# Altium project DSUB-Platine-V2.PrjPcb
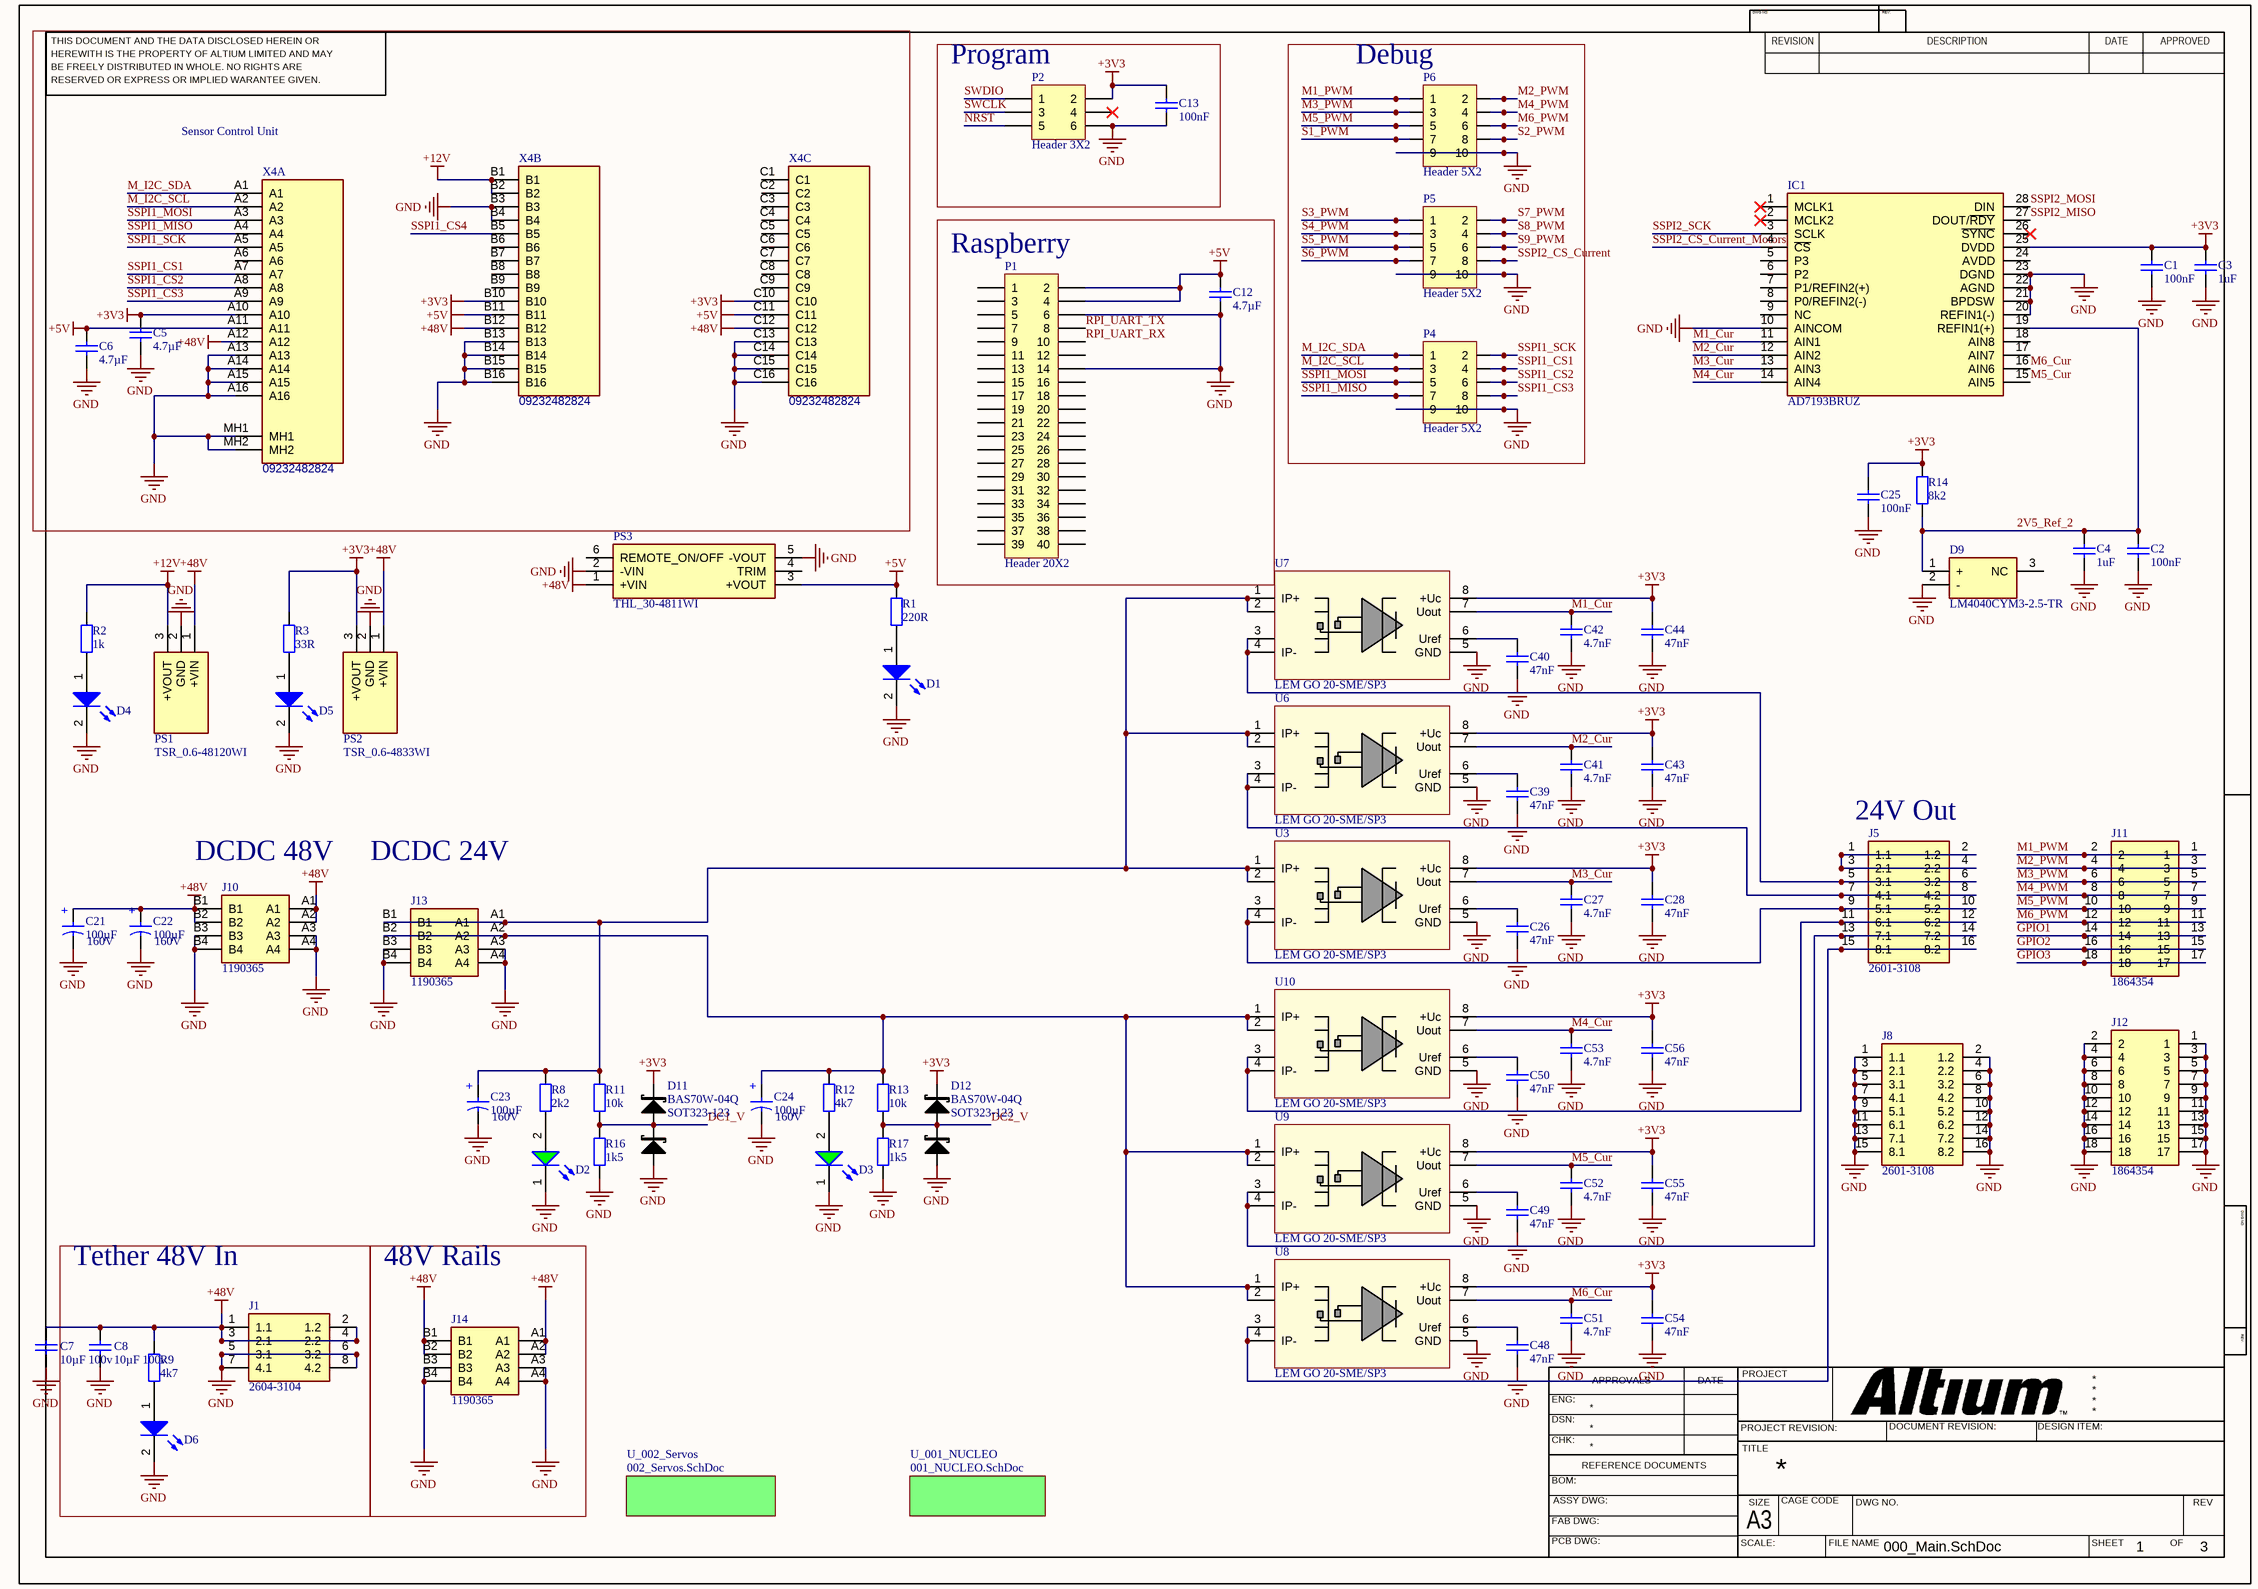
[diagram p0: 000_Main.SchDoc]
3 sheets, 125 parts. Net scope: global (net labels, ports and power ports of the same name join across sheets).
Board file: DSUB_V2_JGl_RoV24_RevA.PcbDoc
Sheets:
  000_Main.SchDoc
    U_001_NUCLEO = 001_NUCLEO.SchDoc
    U_002_Servos = 002_Servos.SchDoc

## Sheet 000_Main.SchDoc
size 420 x 297 mm; SheetNumber: 1; SheetTotal: 3; SPICEModelCacheKMNAYMJK: <root> / <DocumentId>KMNAYMJK</DocumentId> / <CacheFrame Number="0"> / <Model Name="0603_150060gs84000" Kind="CKT"> / <Text>****** / .subckt 0603_150060GS84000  1  2 / D1 1 2 SMCW / .MODEL SMCW D / + IS=695.94E-6 / + N=5 / + RS=2.4677 / + IKF=16.109E-12 / + CJO=1.0000E-12 / + M=.3333 / + VJ=.75 / + BV=5 / + IBV=100.00E-6 / + TT=5.0000E-9 / .ends</Text> / </Model> / <Model Name="0603_150060bs75003" Kind="CKT"> / <Text>****** / .subckt 0603_150060BS75003  1  2 / D1 1 2 SMCW / .MODEL SMCW D / + IS=695.94E-6 / + N=5 / + RS=2.4677 / + IKF=16.109E-12 / + CJO=1.0000E-12 / + M=.3333 / + VJ=.75 / + BV=5 / + IBV=10.00E-6 / + TT=5.0000E-9 / .ends</Text> / </Model> / <Model Name="1210_885012209048_4.7uf" Kind="CKT"> / <Text>******* / .subckt 1210_885012209048_4.7uF 1 2 / Rser 1 3 0.00278836774782 / Lser 2 4 2.60340728E-10 / C1 3 4 0.0000047 / Rpar 3 4 20000000 / .ends 1210_885012209048_4.7uF</Text> / </Model> / <Model Name="2220_885012214006_10uf" Kind="CKT"> / <Text>******* / .subckt 2220_885012214006_10uF 1 2 / Rser 1 3 0.003 / Lser 2 4 0.0000000012 / C1 3 4 0.00001 / Rpar 3 4 10000000 / .ends 2220_885012214006_10uF</Text> / </Model> / <Model Name="0805_885012207098r_100nf" Kind="CKT"> / <Text>******* / .subckt 0805_885012207098R_100nF 1 2 / Rser 1 3 0.0175748078756 / Lser 2 4 0.0000000004 / C1 3 4 0.0000001 / Rpar 3 4 5000000000 / .ends 0805_885012207098R_100nF</Text> / </Model> / </CacheFrame> / </root>

### Parts
C1  100nF  [6-0805_L]
C2  100nF  [6-0805_L]
C3  1uF  [6-0805_L]
C4  1uF  [6-0805_L]
C5  4.7µF  [WCAP-CSGP_1210_L3.2W2.5H2.5]
C6  4.7µF  [WCAP-CSGP_1210_L3.2W2.5H2.5]
C7  10µF 100v  [WCAP-CSGP_2220_L5.7W5H2.8]
C8  10µF 100v  [WCAP-CSGP_2220_L5.7W5H2.8]
C12  4.7µF  [WCAP-CSGP_1210_L3.2W2.5H2.5]
C13  100nF  [WCAP-CSGP_0805_L2W1.25H0.8_Reflow]
C21  Rated Voltage (DC): 160V  [WCAP-AT1H_D18H21]  (hidden comment: 100µF)
C22  Rated Voltage (DC): 160V  [WCAP-AT1H_D18H21]  (hidden comment: 100µF)
C23  Rated Voltage (DC): 160V  [WCAP-AT1H_D18H21]  (hidden comment: 100µF)
C24  Rated Voltage (DC): 160V  [WCAP-AT1H_D18H21]  (hidden comment: 100µF)
C25  100nF  [6-0805_L]
C26  47nF  [WCAP-CSGP_0805_L2W1.25H0.8_Reflow]
C27  4.7nF  [WCAP-CSGP_0805_L2W1.25H0.8_Reflow]
C28  47nF  [WCAP-CSGP_0805_L2W1.25H0.8_Reflow]
C39  47nF  [WCAP-CSGP_0805_L2W1.25H0.8_Reflow]
C40  47nF  [WCAP-CSGP_0805_L2W1.25H0.8_Reflow]
C41  4.7nF  [WCAP-CSGP_0805_L2W1.25H0.8_Reflow]
C42  4.7nF  [WCAP-CSGP_0805_L2W1.25H0.8_Reflow]
C43  47nF  [WCAP-CSGP_0805_L2W1.25H0.8_Reflow]
C44  47nF  [WCAP-CSGP_0805_L2W1.25H0.8_Reflow]
C48  47nF  [WCAP-CSGP_0805_L2W1.25H0.8_Reflow]
C49  47nF  [WCAP-CSGP_0805_L2W1.25H0.8_Reflow]
C50  47nF  [WCAP-CSGP_0805_L2W1.25H0.8_Reflow]
C51  4.7nF  [WCAP-CSGP_0805_L2W1.25H0.8_Reflow]
C52  4.7nF  [WCAP-CSGP_0805_L2W1.25H0.8_Reflow]
C53  4.7nF  [WCAP-CSGP_0805_L2W1.25H0.8_Reflow]
C54  47nF  [WCAP-CSGP_0805_L2W1.25H0.8_Reflow]
C55  47nF  [WCAP-CSGP_0805_L2W1.25H0.8_Reflow]
C56  47nF  [WCAP-CSGP_0805_L2W1.25H0.8_Reflow]
D1  Blue, 3.2V, 140°  [WL-SMCW_0603_150060xx75003]  (value not drawn)
D2  Green, 3.3V, 40°  [WL-SMCW_0603_150060xx8x000]  (value not drawn)
D3  Green, 3.3V, 40°  [WL-SMCW_0603_150060xx8x000]  (value not drawn)
D4  Blue, 3.2V, 140°  [WL-SMCW_0603_150060xx75003]  (value not drawn)
D5  Blue, 3.2V, 140°  [WL-SMCW_0603_150060xx75003]  (value not drawn)
D6  Blue, 3.2V, 140°  [WL-SMCW_0603_150060xx75003]  (value not drawn)
D9  LM4040CYM3-2.5-TR  [SOT - 23]
D11  BAS70W-04Q  [SOT323-123]
D12  BAS70W-04Q  [SOT323-123]
IC1  AD7193BRUZ  [SOP65P640X120-28N]
J1  2604-3104  [26043104]
J5  2601-3108  [26013108]
J8  2601-3108  [26013108]
J10  1190365  [1190365]
J11  1864354  [1864354]
J12  1864354  [1864354]
J13  1190365  [1190365]
J14  1190365  [1190365]
P1  Header 20X2  [HDR2X20]
P2  Header 3X2  [HDR2X3]
P4  Header 5X2  [HDR2X5]
P5  Header 5X2  [HDR2X5]
P6  Header 5X2  [HDR2X5]
PS1  TSR_0.6-48120WI  [TSR0648120WI]
PS2  TSR_0.6-4833WI  [TSR0648120WI]
PS3  THL_30-4811WI  [THL304811WI]
R1  220R  [6-0805_M]
R2  1k  [6-0805_M]
R3  33R  [6-0805_M]
R8  2k2  [6-0805_M]
R9  4k7  [6-0805_M]
R11  10k  [6-0805_M]
R12  4k7  [6-0805_M]
R13  10k  [6-0805_M]
R14  8k2  [6-0805_M]
R16  1k5  [6-0805_M]
R17  1k5  [6-0805_M]
U3  LEM GO 20-SME/SP3  [Lem_sme_SOIC8]
U6  LEM GO 20-SME/SP3  [Lem_sme_SOIC8]
U7  LEM GO 20-SME/SP3  [Lem_sme_SOIC8]
U8  LEM GO 20-SME/SP3  [Lem_sme_SOIC8]
U9  LEM GO 20-SME/SP3  [Lem_sme_SOIC8]
U10  LEM GO 20-SME/SP3  [Lem_sme_SOIC8]
X4  09232482824  [09232482824]  (parts A,B,C of 3)

### Blocks framed on the sheet
Sensor Control Unit: C5 C6 X4
Program: C13 P2
Debug: P4-P6
Raspberry: C12 P1
Tether 48V In: C8 D6 J1 R9
48V Rails: J14

### Sub-sheets
U_001_NUCLEO = 001_NUCLEO.SchDoc: no entries
U_002_Servos = 002_Servos.SchDoc: no entries

### Nets
+3V3: C1.2 C3.2 C5.2 C13.1 C25.2 C28.2 C43.2 C44.2 C54.2 C55.2 C56.2 D11.2 D12.2 IC1.25(DVDD) P2.2 PS2.3(+VOUT) R3.2 R14.2 U3.8(+Uc) U6.8(+Uc) U7.8(+Uc) U8.8(+Uc) U9.8(+Uc) U10.8(+Uc) X4.A10 X4.B10 X4.C10
+5V: C6.2 C12.2 P1.2 P1.4 PS3.3(+VOUT) R1.2 X4.A11 X4.B11 X4.C11
+12V: PS1.3(+VOUT) R2.2 X4.B1 X4.B2
+48V: C7.2 C8.2 C21.1(P) C22.1(P) J1.1(1.1) J1.2(1.2) J1.3(2.1) J1.4(2.2) J10.A1 J10.A2 J10.B1 J10.B2 J14.A1 J14.A2 J14.B1 J14.B2 PS1.1(+VIN) PS2.1(+VIN) PS3.1(+VIN) R9.2 X4.A12 X4.B12 X4.C12
GND: C1.1 C2.1 C3.1 C4.1 C5.1 C6.1 C7.1 C8.1 C12.1 C13.2 C21.2(N) C22.2(N) C23.2(N) C24.2(N) C25.1 C26.1 C27.1 C28.1 C39.1 C40.1 C41.1 C42.1 C43.1 C44.1 C48.1 C49.1 C50.1 C51.1 C52.1 C53.1 C54.1 C55.1 C56.1 D1.2(K) D2.1(K) D3.1(K) D4.2(K) D5.2(K) D6.2(K) D9.2(-) D11.1 D12.1 IC1.10(AINCOM) IC1.20(REFIN1(-)) IC1.21(BPDSW) IC1.22(AGND) IC1.23(DGND) J1.5(3.1) J1.6(3.2) J1.7(4.1) J1.8(4.2) J8.1(1.1) J8.2(1.2) J8.3(2.1) J8.4(2.2) J8.5(3.1) J8.6(3.2) J8.7(4.1) J8.8(4.2) J8.9(5.1) J8.10(5.2) J8.11(6.1) J8.12(6.2) J8.13(7.1) J8.14(7.2) J8.15(8.1) J8.16(8.2) J10.A3 J10.A4 J10.B3 J10.B4 J12.1 J12.2 J12.3 J12.4 J12.5 J12.6 J12.7 J12.8 J12.9 J12.10 J12.11 J12.12 J12.13 J12.14 J12.15 J12.16 J12.17 J12.18 J13.A3 J13.A4 J13.B3 J13.B4 J14.A3 J14.A4 J14.B3 J14.B4 P1.6 P1.14 P2.6 P4.9 P4.10 P5.9 P5.10 P6.9 P6.10 PS1.2(GND) PS2.2(GND) PS3.2(-VIN) PS3.5(-VOUT) R16.1 R17.1 U3.5(GND) U6.5(GND) U7.5(GND) U8.5(GND) U9.5(GND) U10.5(GND) X4.A13 X4.A14 X4.A15 X4.A16 X4.B3 X4.B4 X4.B13 X4.B14 X4.B15 X4.B16 X4.C13 X4.C14 X4.C15 X4.C16 X4.MH1 X4.MH2
2V5_Ref_2: C2.2 C4.2 D9.1(+) IC1.19(REFIN1(+)) R14.1
DC1_V: D11.3 R11.1 R16.2
DC2_V: D12.3 R13.1 R17.2
GPIO1: J11.13 J11.14
GPIO2: J11.15 J11.16
GPIO3: J11.17 J11.18
M1_Cur: C42.2 IC1.11(AIN1) U7.7(Uout)
M1_PWM: J11.1 J11.2 P6.1
M2_Cur: C41.2 IC1.12(AIN2) U6.7(Uout)
M2_PWM: J11.3 J11.4 P6.2
M3_Cur: C27.2 IC1.13(AIN3) U3.7(Uout)
M3_PWM: J11.5 J11.6 P6.3
M4_Cur: C53.2 IC1.14(AIN4) U10.7(Uout)
M4_PWM: J11.7 J11.8 P6.4
M5_Cur: C52.2 IC1.15(AIN5) U9.7(Uout)
M5_PWM: J11.9 J11.10 P6.5
M6_Cur: C51.2 IC1.16(AIN6) U8.7(Uout)
M6_PWM: J11.11 J11.12 P6.6
M_I2C_SCL: P4.3 X4.A2
M_I2C_SDA: P4.1 X4.A1
NRST: P2.5
RPI_UART_RX: P1.10
RPI_UART_TX: P1.8
S1_PWM: P6.7
S2_PWM: P6.8
S3_PWM: P5.1
S4_PWM: P5.3
S5_PWM: P5.5
S6_PWM: P5.7
S7_PWM: P5.2
S8_PWM: P5.4
S9_PWM: P5.6
SSPI1_CS1: P4.4 X4.A7
SSPI1_CS2: P4.6 X4.A8
SSPI1_CS3: P4.8 X4.A9
SSPI1_CS4: X4.B5
SSPI1_MISO: P4.7 X4.A4
SSPI1_MOSI: P4.5 X4.A3
SSPI1_SCK: P4.2 X4.A5
SSPI2_CS_Current: P5.8
SSPI2_CS_Current_Motors: IC1.4(~{CS})
SSPI2_MISO: IC1.27(DOUT/~{RDY})
SSPI2_MOSI: IC1.28(DIN)
SSPI2_SCK: IC1.3(SCLK)
SWCLK: P2.3
SWDIO: P2.1
NetC23_1: C23.1(P) J13.A1 J13.B1 R8.2 R11.2 U3.1(IP+) U3.2 U6.1(IP+) U6.2 U7.1(IP+) U7.2
NetC24_1: C24.1(P) J13.A2 J13.B2 R12.2 R13.2 U8.1(IP+) U8.2 U9.1(IP+) U9.2 U10.1(IP+) U10.2
NetC26_2: C26.2 U3.6(Uref)
NetC39_2: C39.2 U6.6(Uref)
NetC40_2: C40.2 U7.6(Uref)
NetC48_2: C48.2 U8.6(Uref)
NetC49_2: C49.2 U9.6(Uref)
NetC50_2: C50.2 U10.6(Uref)
NetD1_1: D1.1(A) R1.1
NetD2_2: D2.2(A) R8.1
NetD3_2: D3.2(A) R12.1
NetD4_1: D4.1(A) R2.1
NetD5_1: D5.1(A) R3.1
NetD6_1: D6.1(A) R9.1
NetJ5_1: J5.1(1.1) J5.2(1.2) J5.3(2.1) J5.4(2.2)
NetJ5_5: J5.5(3.1) J5.6(3.2) U7.3 U7.4(IP-)
NetJ5_7: J5.7(4.1) J5.8(4.2) U6.3 U6.4(IP-)
NetJ5_9: J5.9(5.1) J5.10(5.2) U3.3 U3.4(IP-)
NetJ5_11: J5.11(6.1) J5.12(6.2) U10.3 U10.4(IP-)
NetJ5_13: J5.13(7.1) J5.14(7.2) U9.3 U9.4(IP-)
NetJ5_15: J5.15(8.1) J5.16(8.2) U8.3 U8.4(IP-)

Not connected (* = marked no-connect by the designer): D9 3(NC); IC1 1(MCLK1)* 2(MCLK2)* 5(P3) 6(P2) 7(P1/REFIN2(+)) 8(P0/REFIN2(-)) 9(NC) 17(AIN7) 18(AIN8) 24(AVDD) 26(~{SYNC})*; P1 1 3 5 7 9 11 12 13 15 16 17 18 19 20 21 22 23 24 25 26 27 28 29 30 31 32 33 34 35 36 37 38 39 40; P2 4*; PS3 4(TRIM) 6(REMOTE_ON/OFF); X4 A6 B6 B7 B8 B9 C1 C2 C3 C4 C5 C6 C7 C8 C9

### Notes on the sheet
- (near J10) DCDC 48V
- DCDC 24V
- (near J5) 24V Out
- THIS DOCUMENT AND THE DATA DISCLOSED HEREIN OR
- HEREWITH IS THE PROPERTY OF ALTIUM LIMITED AND MAY
- DWG NO:
- REVISION
- REV:
- DESCRIPTION
- DATE
- APPROVED
- BE FREELY DISTRIBUTED IN WHOLE. NO RIGHTS ARE
- RESERVED OR EXPRESS OR IMPLIED WARANTEE GIVEN.
- ENG:
- APPROVALS
- PROJECT
- DSN:
- CHK:
- REFERENCE DOCUMENTS
- PROJECT REVISION:
- TITLE
- DOCUMENT REVISION:
- DESIGN ITEM:
- BOM:
- FAB DWG:
- PCB DWG:
- ASSY DWG:
- SCALE:
- A3
- SIZE
- CAGE CODE
- FILE NAME
- DWG NO.
- SHEET
- OF
- REV
- (in symbol 860240981006) +

### Library data of the parts
C1-C4 C25 = Cap: Capacitor; Published: 8-Jun-2000; LatestRevisionDate: 17-Jul-2002; LatestRevisionNote: Re-released for DXP Platform.; PackageReference: RAD-0.3; Publisher: Altium Limited; PackageDescription: Radial Cap, Thru-Hole; 2 Leads; 0.3 in Pin Spacing
  C1 C2 C25: Value: 100nF
  C3 C4: Value: 1uF
C5 C6 C12 = 885012209048: WCAP-CSGP Multilayer Ceramic Chip Capacitor, General Purpose, size 1210, X7R, 4.7µF, 50VDC; Manufacturer: Wurth Elektronik; Case/Size Code: 1210; Capacitance Tolerance: +/-10%; Dissipation Factor: 5%; Insulation Resistance: 0.02GΩ; Rated Voltage (DC): 50V; Technical Reference: X7R1210475K050DFCT10000; Manufacturer Part Number: 885012209048; Category: Multilayer Ceramic Chip Capacitors; Match Code: WCAP-CSGP; ComponentLink1Description: Website Link; ComponentLink1URL: https://www.we-online.com/redexpert/article/885012209048?ad; ComponentLink2Description: Datasheet Link; ComponentLink2URL: https://www.we-online.com/redexpert/spec/885012209048?ad; Mount: Surface Mount; Operating Temperature Max: 125°C; Operating Temperature Min: -55°C; Packaging: Tape and Reel; Length: 3.2mm; Width: 2.5mm; Height: 2.5mm; Capacitance: 4.7µF; Ceramic Type: X7R
C7 C8 = 885012214006: WCAP-CSGP Multilayer Ceramic Chip Capacitor, General Purpose, size 2220, X7R Class II, 10µF, 100VDC; Manufacturer: Wurth Elektronik; Case/Size Code: 2220; Capacitance Tolerance: +/-10%; Dissipation Factor: 2.5%; Insulation Resistance: 0.01GΩ; Technical Reference: X7R2220106K100DFCT10000; Manufacturer Part Number: 885012214006; Category: Multilayer Ceramic Chip Capacitors; Match Code: WCAP-CSGP; ComponentLink1Description: Website Link; ComponentLink1URL: https://www.we-online.com/redexpert/article/885012214006?ad; ComponentLink2Description: Datasheet Link; ComponentLink2URL: https://www.we-online.com/redexpert/spec/885012214006?ad; Mount: Surface Mount; Operating Temperature Max: 125°C; Operating Temperature Min: -55°C; Packaging: Tape and Reel; Length: 5.7mm; Width: 5mm; Height: 2.8mm; Capacitance: 10µF 100v; Ceramic Type: X7R Class II; Rated Voltage (DC): 100V
C13 = 885012207098R: WCAP-CSGP Multilayer Ceramic Chip Capacitor, General Purpose, size 0805, X7R, 100nF, 50VDC; Manufacturer: Wurth Elektronik; Case/Size Code: 0805; Capacitance Tolerance: +/-10%; Dissipation Factor: 2.5%; Insulation Resistance: 5GΩ; Rated Voltage (DC): 50V; Technical Reference: X7R0805104K050DFCT20000; Manufacturer Part Number: 885012207098R; Category: Multilayer Ceramic Chip Capacitors; Match Code: WCAP-CSGP; ComponentLink1Description: Website Link; ComponentLink1URL: https://www.we-online.com/redexpert/article/885012207098R?ad; ComponentLink2Description: Datasheet Link; ComponentLink2URL: https://www.we-online.com/redexpert/spec/885012207098R?ad; Mount: Surface Mount; Operating Temperature Max: 125°C; Operating Temperature Min: -55°C; Packaging: Tape and Reel; Length: 2mm; Width: 1.25mm; Height: 0.8mm; Capacitance: 100nF; Ceramic Type: X7R
C21-C24 = 860240981006: WCAP-AT1H Aluminum Electrolytic Capacitor, Radial, THT, D18 x H21mm, 100µF, 160V; Manufacturer: Wurth Elektronik; Capacitance Tolerance: +/-20%; Dissipation Factor: 15%; Endurance: 10000h; Leakage Current: 740µA; Ripple Current: 1310mA; Technical Reference: ATDL210101M160DSPAEK000; Manufacturer Part Number: 860240981006; Category: Aluminum Electrolytic Capacitors; Match Code: WCAP-AT1H; ComponentLink1Description: Website Link; ComponentLink1URL: https://www.we-online.com/redexpert/article/860240981006?ad; ComponentLink2Description: Datasheet Link; ComponentLink2URL: https://www.we-online.com/redexpert/spec/860240981006?ad; Mount: Through Hole; Operating Temperature Max: 105°C; Operating Temperature Min: -40°C; Packaging: Ammo Pack; Height: 21mm; Diameter: 18mm; Capacitance: 100µF
C26 C28 C39 C40 C43 C44 C48-C50 C54-C56 = 885012207096: WCAP-CSGP Multilayer Ceramic Chip Capacitor, General Purpose, size 0805, X7R, 47nF, 50VDC; Manufacturer: Wurth Elektronik; Case/Size Code: 0805; Capacitance Tolerance: +/-10%; Dissipation Factor: 2.5%; Insulation Resistance: 10GΩ; Rated Voltage (DC): 50V; Technical Reference: X7R0805473K050DFCT10000; Manufacturer Part Number: 885012207096; Category: Multilayer Ceramic Chip Capacitors; Match Code: WCAP-CSGP; ComponentLink1Description: Website Link; ComponentLink1URL: https://www.we-online.com/redexpert/article/885012207096?ad; ComponentLink2Description: Datasheet Link; ComponentLink2URL: https://www.we-online.com/redexpert/spec/885012207096?ad; Mount: Surface Mount; Operating Temperature Max: 125°C; Operating Temperature Min: -55°C; Packaging: Tape and Reel; Length: 2mm; Width: 1.25mm; Height: 0.8mm; Capacitance: 47nF; Ceramic Type: X7R
C27 C41 C42 C51-C53 = 885012207090: WCAP-CSGP Multilayer Ceramic Chip Capacitor, General Purpose, size 0805, X7R, 4.7nF, 50VDC; Manufacturer: Wurth Elektronik; Case/Size Code: 0805; Capacitance Tolerance: +/-10%; Dissipation Factor: 2.5%; Insulation Resistance: 10GΩ; Rated Voltage (DC): 50V; Technical Reference: X7R0805472K050DFCT10000; Manufacturer Part Number: 885012207090; Category: Multilayer Ceramic Chip Capacitors; Match Code: WCAP-CSGP; ComponentLink1Description: Website Link; ComponentLink1URL: https://www.we-online.com/redexpert/article/885012207090?ad; ComponentLink2Description: Datasheet Link; ComponentLink2URL: https://www.we-online.com/redexpert/spec/885012207090?ad; Mount: Surface Mount; Operating Temperature Max: 125°C; Operating Temperature Min: -55°C; Packaging: Tape and Reel; Length: 2mm; Width: 1.25mm; Height: 0.8mm; Capacitance: 4.7nF; Ceramic Type: X7R
D1 D4-D6 = 150060BS75003: WL-SMCW Mono-color Chip LED Waterclear, size 0603, Blue, 3.2V, 140°; Manufacturer: Wurth Elektronik; Case/Size Code: 0603; Chip Technology: InGaN; Dominant Wavelength: 470nm; Luminous Intensity: 350mcd; Peak Wavelength: 465nm; Manufacturer Part Number: 150060BS75003; Category: Signal LEDs; Match Code: WL-SMCW; ComponentLink1Description: Website Link; ComponentLink1URL: https://www.we-online.com/redexpert/article/150060BS75003?ad; ComponentLink2Description: Datasheet Link; ComponentLink2URL: https://www.we-online.com/redexpert/spec/150060BS75003?ad; Mount: Surface Mount; Operating Temperature Max: 100°C; Operating Temperature Min: -40°C; Packaging: Tape and Reel; Length: 1.6mm; Width: 0.8mm; Height: 0.7mm; Emitting Color: Blue; Forward Voltage: 3.2V; Viewing Angle: 140°
D2 D3 = 150060GS84000: WL-SMCW Mono-color Chip LED Waterclear, size 0603, Green, 3.3V, 40°; Manufacturer: Wurth Elektronik; Case/Size Code: 0603; Chip Technology: InGaN; Dominant Wavelength: 525nm; Luminous Intensity: 3000mcd; Peak Wavelength: 520nm; Manufacturer Part Number: 150060GS84000; Category: Signal LEDs; Match Code: WL-SMCW; ComponentLink1Description: Website Link; ComponentLink1URL: https://www.we-online.com/redexpert/article/150060GS84000?ad; ComponentLink2Description: Datasheet Link; ComponentLink2URL: https://www.we-online.com/redexpert/spec/150060GS84000?ad; Mount: Surface Mount; Operating Temperature Max: 85°C; Operating Temperature Min: -40°C; Packaging: Tape and Reel; Length: 1.6mm; Width: 0.8mm; Height: 0.95mm; Emitting Color: Green; Forward Voltage: 3.3V; Viewing Angle: 40°
D9 = LM4040CYM3-2.5-TR: Integrated Circuit; Manufacturer_Name: Microchip; Datasheet Link: https://componentsearchengine.com/Datasheets/1/LM4040CYM3-2.5-TR.pdf; Height: 1.11mm; Manufacturer_Part_Number: LM4040CYM3-2.5-TR; Mouser Part Number: 998-LM4040CYM3-2.5TR; Mouser Price/Stock: https://www.mouser.co.uk/ProductDetail/Microchip-Technology/LM4040CYM3-2.5-TR?qs=Y3Q3JoKAO1TBY3WS5dYgqA%3D%3D; Arrow Part Number: LM4040CYM3-2.5-TR; Arrow Price/Stock: https://www.arrow.com/en/products/lm4040cym3-2.5-tr/microchip-technology?region=nac
D11 D12 = Dual Schottky Diode: DUAL SCHOTTKY DIODE SERIES; Model: BAS70W-04Q
IC1 = AD7193BRUZ: Integrated Circuit; Manufacturer_Name: Analog Devices; Datasheet Link: https://www.arrow.com/en/products/ad7193bruz/analog-devices; Height: 1.2mm; Manufacturer_Part_Number: AD7193BRUZ; Mouser Part Number: 584-AD7193BRUZ; Mouser Price/Stock: https://www.mouser.co.uk/ProductDetail/Analog-Devices/AD7193BRUZ?qs=NmRFExCfTkGSEOyDxDZl1A%3D%3D; Arrow Part Number: AD7193BRUZ; Arrow Price/Stock: https://www.arrow.com/en/products/ad7193bruz/analog-devices?region=nac
J1 = 2604-3104: PCB terminal block; lever; 4 mm; Pin spacing 5 mm; 4-pole; Push-in CAGE CLAMP; Manufacturer_Name: Wago; Geometry.Height: 21.3mm; Manufacturer_Part_Number: 2604-3104; Mouser Part Number: *; Mouser Price/Stock: *; Arrow Part Number: 2604-3104; Arrow Price/Stock: https://www.arrow.com/en/products/2604-3104/wago-kontakttechnik-gmbh?region=nac; Datasheet Link: https://www.wago.com/2604-3104
J5 J8 = 2601-3108: Connector; Manufacturer_Name: Wago; Datasheet Link: https://www.wago.com/2601-3108; Height: 16.58mm; Manufacturer_Part_Number: 2601-3108
J10 J13 J14 = 1190365: Fixed Terminal Blocks LPTA 2,5/ 4-5,0; Manufacturer_Name: Phoenix Contact; Geometry.Height: 22.65mm; Mouser Part Number: 651-1190365; Mouser Price/Stock: https://www.mouser.co.uk/ProductDetail/Phoenix-Contact/1190365?qs=QNEnbhJQKvbYhaie4VzA2g%3D%3D; Manufacturer_Part_Number: 1190365; Datasheet Link: http://www.phoenixcontact.net/product/1190365
J11 J12 = 1864354: Conn Terminal Block 9 POS 3.5mm Spring Clamp Thru-Hole 13.5A; Manufacturer_Name: Phoenix Contact; Geometry.Height: 10.9mm; Manufacturer_Part_Number: 1864354; Mouser Part Number: 651-1864354; Mouser Price/Stock: https://www.mouser.co.uk/ProductDetail/Phoenix-Contact/1864354?qs=K5ytOU5dogooOTFQbYZG6w%3D%3D; Arrow Part Number: 1864354; Arrow Price/Stock: https://www.arrow.com/en/products/1864354/phoenix-contact; Datasheet Link: https://datasheet.datasheetarchive.com/originals/distributors/DKDS-31/613782.pdf
P1 = Header 20X2: Header, 20-Pin, Dual row; LatestRevisionDate: 17-Jul-2002; LatestRevisionNote: Re-released for DXP Platform.; Publisher: Altium Limited
P2 = Header 3X2: Header, 3-Pin, Dual row; LatestRevisionDate: 17-Jul-2002; LatestRevisionNote: Re-released for DXP Platform.; Publisher: Altium Limited
P4-P6 = Header 5X2: Header, 5-Pin, Dual row; LatestRevisionDate: 17-Jul-2002; LatestRevisionNote: Re-released for DXP Platform.; Publisher: Altium Limited
PS1 = TSR_0.6-48120WI: Power Supply; Manufacturer_Name: Traco Power; Manufacturer_Part_Number: TSR 0.6-48120WI; Datasheet Link: https://tracopower.com/tsr0-6wi-datasheet/; Height: 13.4mm; Mouser Part Number: 495-TSR0.6-48120WI; Mouser Price/Stock: https://www.mouser.co.uk/ProductDetail/TRACO-Power/TSR-0.6-48120WI?qs=XeJtXLiO41RYifRYPPRcXw%3D%3D
PS2 = TSR_0.6-4833WI: Power Supply; Manufacturer_Name: Traco Power; Manufacturer_Part_Number: TSR 0.6-4833WI; Datasheet Link: https://tracopower.com/tsr0-6wi-datasheet/; Height: 13.4mm; Mouser Part Number: 495-TSR0.6-4833WI; Mouser Price/Stock: https://www.mouser.co.uk/ProductDetail/TRACO-Power/TSR-06-4833WI?qs=XeJtXLiO41TOoSnX4kC9jQ%3D%3D
PS3 = THL_30-4811WI: Power Supply; Manufacturer_Name: Traco Power; Manufacturer_Part_Number: THL 30-4811WI; Datasheet Link: https://tracopower.com/thl30wi-datasheet/; Height: 10.7mm; Mouser Part Number: 495-THL30-4811WI; Mouser Price/Stock: https://www.mouser.co.uk/ProductDetail/TRACO-Power/THL-30-4811WI?qs=Y0Uzf4wQF3nJ2IvHzeZgKg%3D%3D
R1-R3 R8 R9 R11-R14 R16 R17 = Res2: Resistor; Published: 8-Jun-2000; LatestRevisionDate: 17-Jul-2002; LatestRevisionNote: Re-released for DXP Platform.; PackageReference: AXIAL-0.4; Publisher: Altium Limited; PackageDescription: Axial Device, Thru-Hole; 2 Leads; 0.4 in Pin Spacing
  R1: Value: 220R
  R2: Value: 1k
  R3: Value: 33R
  R8: Value: 2k2
  R9 R12: Value: 4k7
  R11 R13: Value: 10k
  R14: Value: 8k2
  R16 R17: Value: 1k5
U3 U6-U10 = LEM_SME: Integrated Current Transducer GO-SME s; ComponentLink1Description: Datasheet; ComponentLink1URL: https://www.lem.com/sites/default/files/products_datasheets/go-sme_series.pdf; Manufacturer: LEM; Ordering Number: GO 20-SME/SP3
X4 = 09232482824: DIN 2C female straight 48pin, 2.9mm tails, PL1; Manufacturer: HARTING; Geometry.Height: 11.6mm; Ordering Number: 09232482824; Mouser Part Number: 617-09232482824; Mouser Price/Stock: https://www.mouser.co.uk/ProductDetail/HARTING/09232482824?qs=Afqhj6cPmO8bPFy5EsJjEQ%3D%3D; Arrow Part Number: *; Arrow Price/Stock: *; Datasheet Link: https://b2b.harting.com/files/download/PRD/PDF_DS/PDF_DS_09032100001.pdf

## Sheet 001_NUCLEO.SchDoc
size A4; SheetNumber: 2; SheetTotal: 3; SPICEModelCacheIXEBBHUF: <root> / <DocumentId>IXEBBHUF</DocumentId> / <CacheFrame Number="0"> / <Model Name="0603_150060rs75003" Kind="CKT"> / <Text>****** / .subckt 0603_150060RS75003  1  2 / D1 1 2 SMCW / .MODEL SMCW D / + IS=1.0025E-15 / + N=2.2259 / + RS=.3926 / + IKF=240.91E-6 / + CJO=1.0000E-12 / + M=.3333 / + VJ=.75 / + BV=5 / + IBV=10.00E-6 / + TT=5.0000E-9 / .ends</Text> / </Model> / </CacheFrame> / </root>
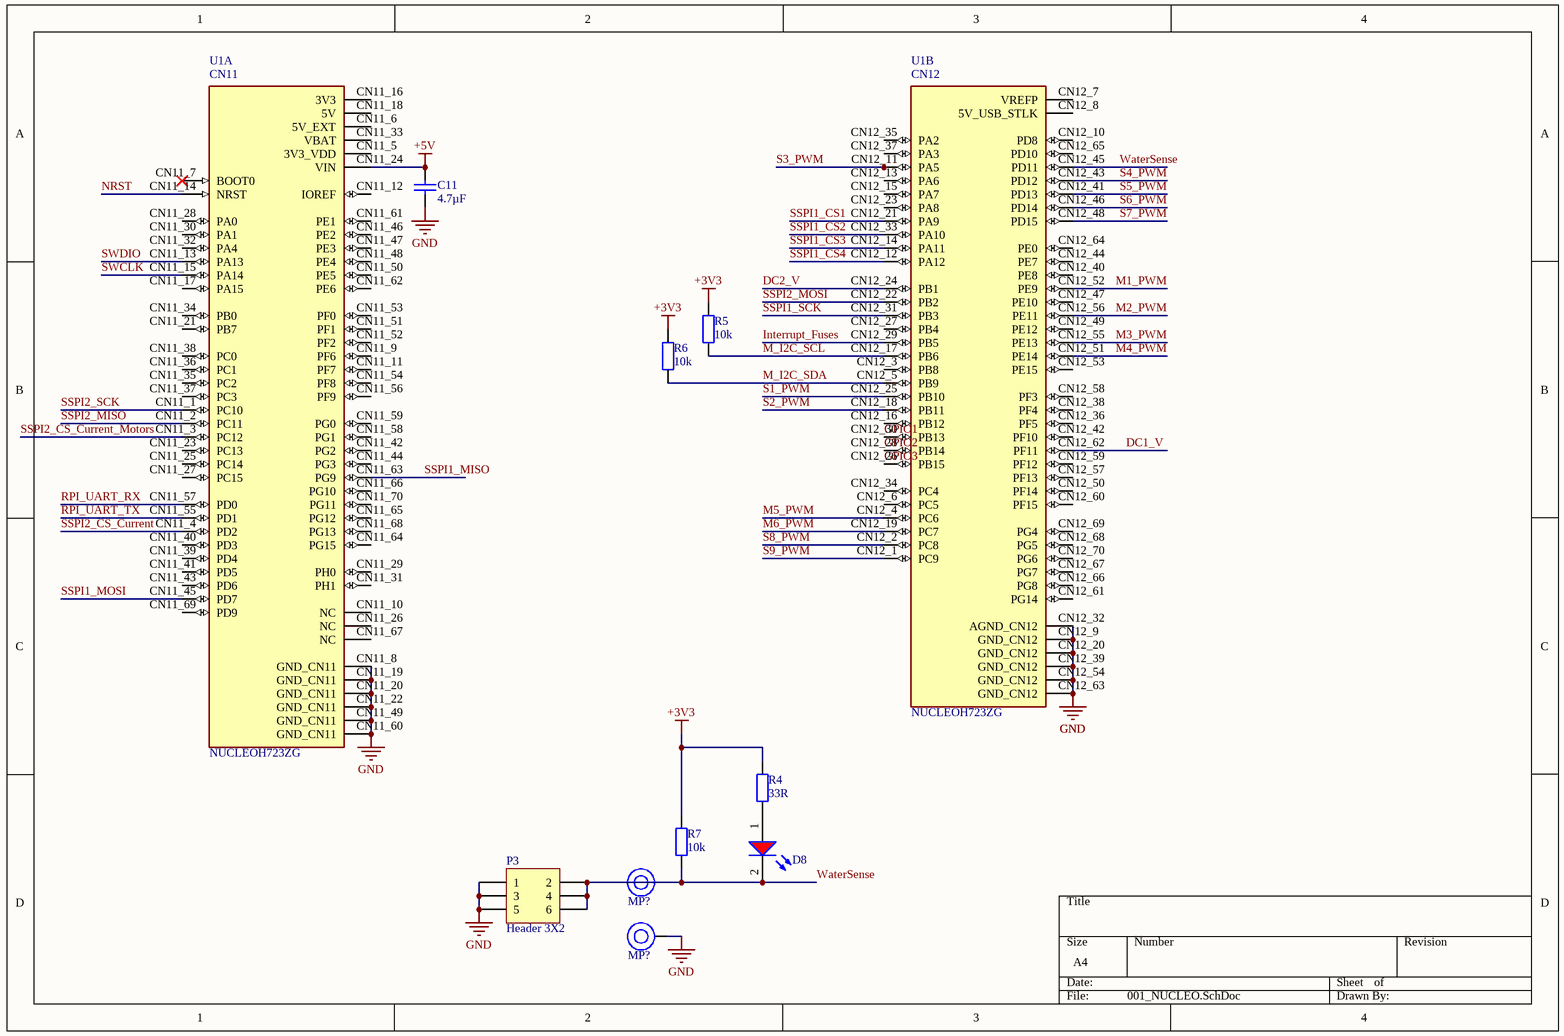
[diagram p1: 001_NUCLEO.SchDoc]

### Parts
(Parts that share a designator on the sheet are numbered #1, #2 ... from top to bottom, then left to right.)
C11  4.7µF  [WCAP-CSGP_1210_L3.2W2.5H2.5]
D8  Red, 2V, 140°  [WL-SMCW_0603_150060xx75003]  (value not drawn)
MP?#1  M3 x 3.6mm  [9775036360]  (value not drawn)  (graphical)
MP?#2  M3 x 3.6mm  [9775036360]  (value not drawn)  (graphical)
P3  Header 3X2  [HDR2X3]
R4  33R  [6-0805_M]
R5  10k  [6-0805_M]
R6  10k  [6-0805_M]
R7  10k  [6-0805_M]
U1  NUCLEOH723ZG  [MODULE_NUCLEOH723ZG]  (parts A,B of 10)

### Nets
+3V3: R4.2 R5.2 R6.2 R7.2
+5V: C11.2 U1.CN11_24(VIN)
GND: C11.1 MP?#2.1 P3.1 P3.3 P3.5 U1.CN11_8(GND_CN11) U1.CN11_19(GND_CN11) U1.CN11_20(GND_CN11) U1.CN11_22(GND_CN11) U1.CN11_49(GND_CN11) U1.CN11_60(GND_CN11) U1.CN12_9(GND_CN12) U1.CN12_20(GND_CN12) U1.CN12_32(AGND_CN12) U1.CN12_39(GND_CN12) U1.CN12_54(GND_CN12) U1.CN12_63(GND_CN12)
DC1_V: U1.CN12_62(PF11)
DC2_V: U1.CN12_24(PB1)
GPIO1: U1.CN12_30(PB13)
GPIO2: U1.CN12_28(PB14)
GPIO3: U1.CN12_26(PB15)
Interrupt_Fuses: U1.CN12_29(PB5)
M1_PWM: U1.CN12_52(PE9)
M2_PWM: U1.CN12_56(PE11)
M3_PWM: U1.CN12_55(PE13)
M4_PWM: U1.CN12_51(PE14)
M5_PWM: U1.CN12_4(PC6)
M6_PWM: U1.CN12_19(PC7)
M_I2C_SCL: R5.1 U1.CN12_17(PB6)
M_I2C_SDA: R6.1 U1.CN12_5(PB9)
NRST: U1.CN11_14(NRST)
RPI_UART_RX: U1.CN11_57(PD0)
RPI_UART_TX: U1.CN11_55(PD1)
S1_PWM: U1.CN12_25(PB10)
S2_PWM: U1.CN12_18(PB11)
S3_PWM: U1.CN12_11(PA5)
S4_PWM: U1.CN12_43(PD12)
S5_PWM: U1.CN12_41(PD13)
S6_PWM: U1.CN12_46(PD14)
S7_PWM: U1.CN12_48(PD15)
S8_PWM: U1.CN12_2(PC8)
S9_PWM: U1.CN12_1(PC9)
SSPI1_CS1: U1.CN12_21(PA9)
SSPI1_CS2: U1.CN12_33(PA10)
SSPI1_CS3: U1.CN12_14(PA11)
SSPI1_CS4: U1.CN12_12(PA12)
SSPI1_MISO: U1.CN11_63(PG9)
SSPI1_MOSI: U1.CN11_45(PD7)
SSPI1_SCK: U1.CN12_31(PB3)
SSPI2_CS_Current: U1.CN11_4(PD2)
SSPI2_CS_Current_Motors: U1.CN11_3(PC12)
SSPI2_MISO: U1.CN11_2(PC11)
SSPI2_MOSI: U1.CN12_22(PB2)
SSPI2_SCK: U1.CN11_1(PC10)
SWCLK: U1.CN11_15(PA14)
SWDIO: U1.CN11_13(PA13)
WaterSense: D8.2(K) MP?#1.1 P3.2 P3.4 P3.6 R7.1 U1.CN12_45(PD11)
NetD8_1: D8.1(A) R4.1

Not connected (* = marked no-connect by the designer): U1 CN11_5(3V3_VDD) CN11_6(5V_EXT) CN11_7(BOOT0)* CN11_9(PF6) CN11_10(NC) CN11_11(PF7) CN11_12(IOREF) CN11_16(3V3) CN11_17(PA15) CN11_18(5V) CN11_21(PB7) CN11_23(PC13) CN11_25(PC14) CN11_26(NC) CN11_27(PC15) CN11_28(PA0) CN11_29(PH0) CN11_30(PA1) CN11_31(PH1) CN11_32(PA4) CN11_33(VBAT) CN11_34(PB0) CN11_35(PC2) CN11_36(PC1) CN11_37(PC3) CN11_38(PC0) CN11_39(PD4) CN11_40(PD3) CN11_41(PD5) CN11_42(PG2) CN11_43(PD6) CN11_44(PG3) CN11_46(PE2) CN11_47(PE3) CN11_48(PE4) CN11_50(PE5) CN11_51(PF1) CN11_52(PF2) CN11_53(PF0) CN11_54(PF8) CN11_56(PF9) CN11_58(PG1) CN11_59(PG0) CN11_61(PE1) CN11_62(PE6) CN11_64(PG15) CN11_65(PG12) CN11_66(PG10) CN11_67(NC) CN11_68(PG13) CN11_69(PD9) CN11_70(PG11) CN12_3(PB8) CN12_6(PC5) CN12_7(VREFP) CN12_8(5V_USB_STLK) CN12_10(PD8) CN12_13(PA6) CN12_15(PA7) CN12_16(PB12) CN12_23(PA8) CN12_27(PB4) CN12_34(PC4) CN12_35(PA2) CN12_36(PF5) CN12_37(PA3) CN12_38(PF4) CN12_40(PE8) CN12_42(PF10) CN12_44(PE7) CN12_47(PE10) CN12_49(PE12) CN12_50(PF14) CN12_53(PE15) CN12_57(PF13) CN12_58(PF3) CN12_59(PF12) CN12_60(PF15) CN12_61(PG14) CN12_64(PE0) CN12_65(PD10) CN12_66(PG8) CN12_67(PG7) CN12_68(PG5) CN12_69(PG4) CN12_70(PG6)

### Notes on the sheet
- (in symbol NUCLEOH723ZG, part A) CN11
- (in symbol NUCLEOH723ZG, part B) CN12

### Library data of the parts
C11 = 885012209048: as C5 on sheet 000_Main; Manufacturer Part Number: 885012209048; Category: Multilayer Ceramic Chip Capacitors; Match Code: WCAP-CSGP; ComponentLink1Description: Website Link; ComponentLink1URL: https://www.we-online.com/redexpert/article/885012209048?ad; ComponentLink2Description: Datasheet Link; ComponentLink2URL: https://www.we-online.com/redexpert/spec/885012209048?ad; Mount: Surface Mount; Operating Temperature Max: 125°C; Operating Temperature Min: -55°C; Packaging: Tape and Reel; Length: 3.2mm; Width: 2.5mm; Height: 2.5mm; Capacitance: 4.7µF; Ceramic Type: X7R
D8 = 150060RS75003: WL-SMCW Mono-color Chip LED Waterclear, size 0603, Red, 2V, 140°; Manufacturer: Wurth Elektronik; Case/Size Code: 0603; Chip Technology: AlInGaP; Dominant Wavelength: 625nm; Luminous Intensity: 530mcd; Peak Wavelength: 630nm; Manufacturer Part Number: 150060RS75003; Category: Signal LEDs; Match Code: WL-SMCW; ComponentLink1Description: Website Link; ComponentLink1URL: https://www.we-online.com/redexpert/article/150060RS75003?ad; ComponentLink2Description: Datasheet Link; ComponentLink2URL: https://www.we-online.com/redexpert/spec/150060RS75003?ad; Mount: Surface Mount; Operating Temperature Max: 100°C; Operating Temperature Min: -40°C; Packaging: Tape and Reel; Length: 1.6mm; Width: 0.8mm; Height: 0.7mm; Emitting Color: Red; Forward Voltage: 2V; Viewing Angle: 140°
MP?#1 MP?#2 = 9775036360: WA-SMSR SMT Steel Spacer Reverse, M3 x 3.6mm; Manufacturer: Wurth Elektronik; Inside Diameter: 4.2mm; Outside Diameter: 6mm; Surface: Tin; ComponentLink1Description: Website Link; ComponentLink1URL: https://www.we-online.com/redexpert/article/9775036360?ad; ComponentLink2Description: Datasheet Link; ComponentLink2URL: https://www.we-online.com/redexpert/spec/9775036360?ad; Manufacturer Part Number: 9775036360; Category: SMT Spacers; Match Code: WA-SMSR; Mount: Surface Mount; Operating Temperature Max: 150°C; Operating Temperature Min: -55°C; Packaging: Bulk; Material: Steel; Pin Length: 3.6mm; Thread Size: M3
P3 = Header 3X2: Header, 3-Pin, Dual row; LatestRevisionDate: 17-Jul-2002; LatestRevisionNote: Re-released for DXP Platform.; Publisher: Altium Limited
R4-R7 = Res2: Resistor; Published: 8-Jun-2000; LatestRevisionDate: 17-Jul-2002; LatestRevisionNote: Re-released for DXP Platform.; PackageReference: AXIAL-0.4; Publisher: Altium Limited; PackageDescription: Axial Device, Thru-Hole; 2 Leads; 0.4 in Pin Spacing
  R4: Value: 33R
  R5-R7: Value: 10k
U1 = NUCLEOH723ZG: STM32H723ZG Nucleo-144 STM32H7 STM32 MCU 32-Bit Embedded Evaluation Board; MF: STMicroelectronics; Value: *; Purchase-URL: https://pricing.snapeda.com/search/part/NUCLEOH723ZG/?ref=eda; Package: None; Check_prices: https://www.snapeda.com/parts/NUCLEOH723ZG/STMicroelectronics/view-part/?ref=eda; MP: NUCLEOH723ZG; Price: None; SnapEDA_Link: https://www.snapeda.com/parts/NUCLEOH723ZG/STMicroelectronics/view-part/?ref=snap; Availability: In Stock

## Sheet 002_Servos.SchDoc
size A4; SheetNumber: 3; SheetTotal: 3; SPICEModelCacheWCGIBJUX: <root> / <DocumentId>WCGIBJUX</DocumentId> / <CacheFrame Number="0"> / <Model Name="0603_150060bs75003" Kind="CKT"> / <Text>****** / .subckt 0603_150060BS75003  1  2 / D1 1 2 SMCW / .MODEL SMCW D / + IS=695.94E-6 / + N=5 / + RS=2.4677 / + IKF=16.109E-12 / + CJO=1.0000E-12 / + M=.3333 / + VJ=.75 / + BV=5 / + IBV=10.00E-6 / + TT=5.0000E-9 / .ends</Text> / </Model> / <Model Name="1210_885012209048_4.7uf" Kind="CKT"> / <Text>******* / .subckt 1210_885012209048_4.7uF 1 2 / Rser 1 3 0.00278836774782 / Lser 2 4 2.60340728E-10 / C1 3 4 0.0000047 / Rpar 3 4 20000000 / .ends 1210_885012209048_4.7uF</Text> / </Model> / <Model Name="1812_885012210032_2.2uf" Kind="CKT"> / <Text>******* / .subckt 1812_885012210032_2.2uF 1 2 / Rser 1 3 0.00377371050938 / Lser 2 4 4.19292053E-10 / C1 3 4 0.0000022 / Rpar 3 4 200000000 / .ends 1812_885012210032_2.2uF</Text> / </Model> / <Model Name="0603_150060rs75003" Kind="CKT"> / <Text>****** / .subckt 0603_150060RS75003  1  2 / D1 1 2 SMCW / .MODEL SMCW D / + IS=1.0025E-15 / + N=2.2259 / + RS=.3926 / + IKF=240.91E-6 / + CJO=1.0000E-12 / + M=.3333 / + VJ=.75 / + BV=5 / + IBV=10.00E-6 / + TT=5.0000E-9 / .ends</Text> / </Model> / </CacheFrame> / </root>
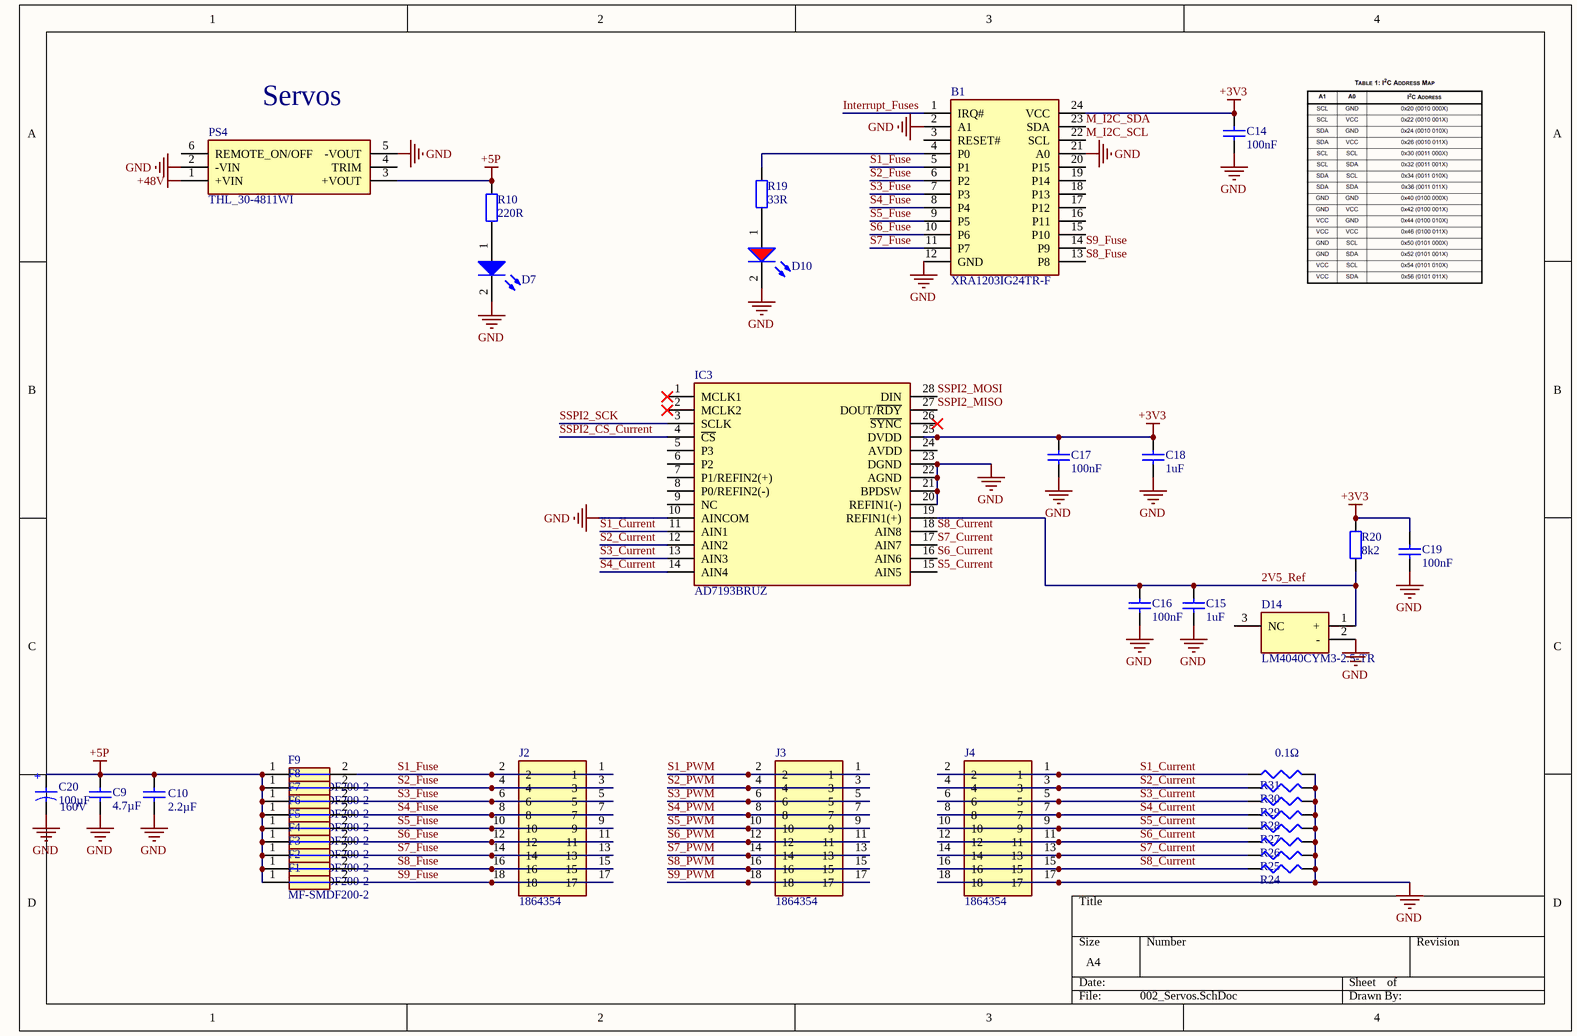
[diagram p2: 002_Servos.SchDoc]

### Parts
B1  XRA1203IG24TR-F  [SOP65P640X120-24N]
C9  4.7µF  [WCAP-CSGP_1210_L3.2W2.5H2.5]
C10  2.2µF  [WCAP-CSGP_1812_L4.5W3.2H2.5]
C14  100nF  [6-0805_L]
C15  1uF  [6-0805_L]
C16  100nF  [6-0805_L]
C17  100nF  [6-0805_L]
C18  1uF  [6-0805_L]
C19  100nF  [6-0805_L]
C20  Rated Voltage (DC): 160V  [WCAP-AT1H_D18H21]  (hidden comment: 100µF)
D7  Blue, 3.2V, 140°  [WL-SMCW_0603_150060xx75003]  (value not drawn)
D10  Red, 2V, 140°  [WL-SMCW_0603_150060xx75003]  (value not drawn)
D14  LM4040CYM3-2.5-TR  [SOT - 23]
F1  MF-SMDF200-2  [FUSC5146X85N]
F2  MF-SMDF200-2  [FUSC5146X85N]
F3  MF-SMDF200-2  [FUSC5146X85N]
F4  MF-SMDF200-2  [FUSC5146X85N]
F5  MF-SMDF200-2  [FUSC5146X85N]
F6  MF-SMDF200-2  [FUSC5146X85N]
F7  MF-SMDF200-2  [FUSC5146X85N]
F8  MF-SMDF200-2  [FUSC5146X85N]
F9  MF-SMDF200-2  [FUSC5146X85N]
IC3  AD7193BRUZ  [SOP65P640X120-28N]
J2  1864354  [1864354]
J3  1864354  [1864354]
J4  1864354  [1864354]
PS4  THL_30-4811WI  [THL304811WI]
R10  220R  [6-0805_M]
R19  33R  [6-0805_M]
R20  8k2  [6-0805_M]
R24  0.1Ω  [WRIS-KSKE_0805_L2W1.25H0.6]  (value not drawn)
R25  0.1Ω  [WRIS-KSKE_0805_L2W1.25H0.6]  (value not drawn)
R26  0.1Ω  [WRIS-KSKE_0805_L2W1.25H0.6]  (value not drawn)
R27  0.1Ω  [WRIS-KSKE_0805_L2W1.25H0.6]  (value not drawn)
R28  0.1Ω  [WRIS-KSKE_0805_L2W1.25H0.6]  (value not drawn)
R29  0.1Ω  [WRIS-KSKE_0805_L2W1.25H0.6]  (value not drawn)
R30  0.1Ω  [WRIS-KSKE_0805_L2W1.25H0.6]  (value not drawn)
R31  0.1Ω  [WRIS-KSKE_0805_L2W1.25H0.6]

### Nets
+3V3: B1.24(VCC) C14.2 C17.2 C18.2 C19.2 IC3.25(DVDD) R20.2
+5P: C9.2 C10.2 C20.1(P) F1.1 F2.1 F3.1 F4.1 F5.1 F6.1 F7.1 F8.1 F9.1 PS4.3(+VOUT) R10.2
+48V: PS4.1(+VIN)
GND: B1.2(A1) B1.12(GND) B1.21(A0) C9.1 C10.1 C14.1 C15.1 C16.1 C17.1 C18.1 C19.1 C20.2(N) D7.2(K) D10.2(K) D14.2(-) IC3.10(AINCOM) IC3.20(REFIN1(-)) IC3.21(BPDSW) IC3.22(AGND) IC3.23(DGND) J4.17 J4.18 PS4.2(-VIN) PS4.5(-VOUT) R24.2 R25.2 R26.2 R27.2 R28.2 R29.2 R30.2 R31.2
2V5_Ref: C15.2 C16.2 D14.1(+) IC3.19(REFIN1(+)) R20.1
Interrupt_Fuses: B1.1(IRQ#)
M_I2C_SCL: B1.22(SCL)
M_I2C_SDA: B1.23(SDA)
S1_Current: IC3.11(AIN1) J4.1 J4.2 R31.1
S1_Fuse: B1.5(P1) F9.2 J2.1 J2.2
S1_PWM: J3.1 J3.2
S2_Current: IC3.12(AIN2) J4.3 J4.4 R30.1
S2_Fuse: B1.6(P2) F8.2 J2.3 J2.4
S2_PWM: J3.3 J3.4
S3_Current: IC3.13(AIN3) J4.5 J4.6 R29.1
S3_Fuse: B1.7(P3) F7.2 J2.5 J2.6
S3_PWM: J3.5 J3.6
S4_Current: IC3.14(AIN4) J4.7 J4.8 R28.1
S4_Fuse: B1.8(P4) F6.2 J2.7 J2.8
S4_PWM: J3.7 J3.8
S5_Current: IC3.15(AIN5) J4.9 J4.10 R27.1
S5_Fuse: B1.9(P5) F5.2 J2.9 J2.10
S5_PWM: J3.9 J3.10
S6_Current: IC3.16(AIN6) J4.11 J4.12 R26.1
S6_Fuse: B1.10(P6) F4.2 J2.11 J2.12
S6_PWM: J3.11 J3.12
S7_Current: IC3.17(AIN7) J4.13 J4.14 R25.1
S7_Fuse: B1.11(P7) F3.2 J2.13 J2.14
S7_PWM: J3.13 J3.14
S8_Current: IC3.18(AIN8) J4.15 J4.16 R24.1
S8_Fuse: B1.13(P8) F2.2 J2.15 J2.16
S8_PWM: J3.15 J3.16
S9_Fuse: B1.14(P9) F1.2 J2.17 J2.18
S9_PWM: J3.17 J3.18
SSPI2_CS_Current: IC3.4(~{CS})
SSPI2_MISO: IC3.27(DOUT/~{RDY})
SSPI2_MOSI: IC3.28(DIN)
SSPI2_SCK: IC3.3(SCLK)
NetB1_4: B1.4(P0) R19.2
NetD7_1: D7.1(A) R10.1
NetD10_1: D10.1(A) R19.1

Not connected (* = marked no-connect by the designer): B1 3(RESET#) 15(P10) 16(P11) 17(P12) 18(P13) 19(P14) 20(P15); D14 3(NC); IC3 1(MCLK1)* 2(MCLK2)* 5(P3) 6(P2) 7(P1/REFIN2(+)) 8(P0/REFIN2(-)) 9(NC) 24(AVDD) 26(~{SYNC})*; PS4 4(TRIM) 6(REMOTE_ON/OFF)

### Notes on the sheet
- (near PS4) Servos
- (in symbol 860240981006) +

### Library data of the parts
B1 = XRA1203IG24TR-F: Interface - I/O Expanders 16 Bit I2C GPIO Expander; Manufacturer_Name: EXAR; Geometry.Height: 1.2mm; Mouser Part Number: 701-XRA1203IG24TR-F; Mouser Price/Stock: https://www.mouser.com/Search/Refine.aspx?Keyword=701-XRA1203IG24TR-F; Manufacturer_Part_Number: XRA1203IG24TR-F; Datasheet Link: https://componentsearchengine.com/Datasheets/1/XRA1203IG24TR-F.pdf
C9 = 885012209048: as C5 on sheet 000_Main; Manufacturer Part Number: 885012209048; Category: Multilayer Ceramic Chip Capacitors; Match Code: WCAP-CSGP; ComponentLink1Description: Website Link; ComponentLink1URL: https://www.we-online.com/redexpert/article/885012209048?ad; ComponentLink2Description: Datasheet Link; ComponentLink2URL: https://www.we-online.com/redexpert/spec/885012209048?ad; Mount: Surface Mount; Operating Temperature Max: 125°C; Operating Temperature Min: -55°C; Packaging: Tape and Reel; Length: 3.2mm; Width: 2.5mm; Height: 2.5mm; Capacitance: 4.7µF; Ceramic Type: X7R
C10 = 885012210032: WCAP-CSGP Multilayer Ceramic Chip Capacitor, General Purpose, size 1812, X7R, 2.2µF, 50VDC; Manufacturer: Wurth Elektronik; Case/Size Code: 1812; Capacitance Tolerance: +/-10%; Dissipation Factor: 2.5%; Insulation Resistance: 0.2GΩ; Rated Voltage (DC): 50V; Technical Reference: X7R1812225K050DFCT10000; Manufacturer Part Number: 885012210032; Category: Multilayer Ceramic Chip Capacitors; Match Code: WCAP-CSGP; ComponentLink1Description: Website Link; ComponentLink1URL: https://www.we-online.com/redexpert/article/885012210032?ad; ComponentLink2Description: Datasheet Link; ComponentLink2URL: https://www.we-online.com/redexpert/spec/885012210032?ad; Mount: Surface Mount; Operating Temperature Max: 125°C; Operating Temperature Min: -55°C; Packaging: Tape and Reel; Length: 4.5mm; Width: 3.2mm; Height: 2.5mm; Capacitance: 2.2µF; Ceramic Type: X7R
C14-C19 = Cap: Capacitor; Published: 8-Jun-2000; LatestRevisionDate: 17-Jul-2002; LatestRevisionNote: Re-released for DXP Platform.; PackageReference: RAD-0.3; Publisher: Altium Limited; PackageDescription: Radial Cap, Thru-Hole; 2 Leads; 0.3 in Pin Spacing
  C14 C16 C17 C19: Value: 100nF
  C15 C18: Value: 1uF
C20 = 860240981006: as C21 on sheet 000_Main; Manufacturer Part Number: 860240981006; Category: Aluminum Electrolytic Capacitors; Match Code: WCAP-AT1H; ComponentLink1Description: Website Link; ComponentLink1URL: https://www.we-online.com/redexpert/article/860240981006?ad; ComponentLink2Description: Datasheet Link; ComponentLink2URL: https://www.we-online.com/redexpert/spec/860240981006?ad; Mount: Through Hole; Operating Temperature Max: 105°C; Operating Temperature Min: -40°C; Packaging: Ammo Pack; Height: 21mm; Diameter: 18mm; Capacitance: 100µF
D7 = 150060BS75003: as D1 on sheet 000_Main; Manufacturer Part Number: 150060BS75003; Category: Signal LEDs; Match Code: WL-SMCW; ComponentLink1Description: Website Link; ComponentLink1URL: https://www.we-online.com/redexpert/article/150060BS75003?ad; ComponentLink2Description: Datasheet Link; ComponentLink2URL: https://www.we-online.com/redexpert/spec/150060BS75003?ad; Mount: Surface Mount; Operating Temperature Max: 100°C; Operating Temperature Min: -40°C; Packaging: Tape and Reel; Length: 1.6mm; Width: 0.8mm; Height: 0.7mm; Emitting Color: Blue; Forward Voltage: 3.2V; Viewing Angle: 140°
D10 = 150060RS75003: as D8 on sheet 001_NUCLEO; Manufacturer Part Number: 150060RS75003; Category: Signal LEDs; Match Code: WL-SMCW; ComponentLink1Description: Website Link; ComponentLink1URL: https://www.we-online.com/redexpert/article/150060RS75003?ad; ComponentLink2Description: Datasheet Link; ComponentLink2URL: https://www.we-online.com/redexpert/spec/150060RS75003?ad; Mount: Surface Mount; Operating Temperature Max: 100°C; Operating Temperature Min: -40°C; Packaging: Tape and Reel; Length: 1.6mm; Width: 0.8mm; Height: 0.7mm; Emitting Color: Red; Forward Voltage: 2V; Viewing Angle: 140°
D14 = LM4040CYM3-2.5-TR: as D9 on sheet 000_Main; Datasheet Link: https://componentsearchengine.com/Datasheets/1/LM4040CYM3-2.5-TR.pdf; Height: 1.11mm; Manufacturer_Part_Number: LM4040CYM3-2.5-TR; Mouser Part Number: 998-LM4040CYM3-2.5TR; Mouser Price/Stock: https://www.mouser.co.uk/ProductDetail/Microchip-Technology/LM4040CYM3-2.5-TR?qs=Y3Q3JoKAO1TBY3WS5dYgqA%3D%3D; Arrow Part Number: LM4040CYM3-2.5-TR; Arrow Price/Stock: https://www.arrow.com/en/products/lm4040cym3-2.5-tr/microchip-technology?region=nac
F1-F9 = MF-SMDF200-2: Fuse; Manufacturer_Name: Bourns; Datasheet Link: https://www.bourns.com/docs/product-datasheets/mf-smdf.pdf?sfvrsn=df432e3c_40; Height: 0.85mm; Manufacturer_Part_Number: MF-SMDF200-2; Mouser Part Number: 652-MF-SMDF200-2; Mouser Price/Stock: https://www.mouser.co.uk/ProductDetail/Bourns/MF-SMDF200-2?qs=NmEazmuVvbUP9opuVlBLcQ%3D%3D; Arrow Part Number: MF-SMDF200-2; Arrow Price/Stock: https://www.arrow.com/en/products/mf-smdf200-2/bourns?region=nac
IC3 = AD7193BRUZ: as IC1 on sheet 000_Main; Datasheet Link: https://www.arrow.com/en/products/ad7193bruz/analog-devices; Height: 1.2mm; Manufacturer_Part_Number: AD7193BRUZ; Mouser Part Number: 584-AD7193BRUZ; Mouser Price/Stock: https://www.mouser.co.uk/ProductDetail/Analog-Devices/AD7193BRUZ?qs=NmRFExCfTkGSEOyDxDZl1A%3D%3D; Arrow Part Number: AD7193BRUZ; Arrow Price/Stock: https://www.arrow.com/en/products/ad7193bruz/analog-devices?region=nac
J2-J4 = 1864354: as J11 on sheet 000_Main; Manufacturer_Part_Number: 1864354; Mouser Part Number: 651-1864354; Mouser Price/Stock: https://www.mouser.co.uk/ProductDetail/Phoenix-Contact/1864354?qs=K5ytOU5dogooOTFQbYZG6w%3D%3D; Arrow Part Number: 1864354; Arrow Price/Stock: https://www.arrow.com/en/products/1864354/phoenix-contact; Datasheet Link: https://datasheet.datasheetarchive.com/originals/distributors/DKDS-31/613782.pdf
PS4 = THL_30-4811WI: as PS3 on sheet 000_Main; Datasheet Link: https://tracopower.com/thl30wi-datasheet/; Height: 10.7mm; Mouser Part Number: 495-THL30-4811WI; Mouser Price/Stock: https://www.mouser.co.uk/ProductDetail/TRACO-Power/THL-30-4811WI?qs=Y0Uzf4wQF3nJ2IvHzeZgKg%3D%3D
R10 R19 R20 = Res2: Resistor; Published: 8-Jun-2000; LatestRevisionDate: 17-Jul-2002; LatestRevisionNote: Re-released for DXP Platform.; PackageReference: AXIAL-0.4; Publisher: Altium Limited; PackageDescription: Axial Device, Thru-Hole; 2 Leads; 0.4 in Pin Spacing
  R10: Value: 220R
  R19: Value: 33R
  R20: Value: 8k2
R24-R31 = 560050320001: WRIS-KSKE Thick Film Resistor, SMT, size 0805, 0.33W, 0.1Ω, +/-1%; Manufacturer: Wurth Elektronik; Case/Size Code: 0805; Rated Current: 1.81A; Technical Reference: KE0805R100F103LAATP0000; Temperature Coefficient of Resistance: 250ppm/°C; Manufacturer Part Number: 560050320001; Category: Thick Film Resistors; Match Code: WRIS-KSKE; ComponentLink1Description: Website Link; ComponentLink1URL: https://www.we-online.com/redexpert/article/560050320001?ad; ComponentLink2Description: Datasheet Link; ComponentLink2URL: https://www.we-online.com/redexpert/spec/560050320001?ad; Mount: Surface Mount; Operating Temperature Max: 155°C; Operating Temperature Min: -55°C; Packaging: Tape and Reel; Length: 2mm; Width: 1.25mm; Height: 0.6mm; Rated Power: 0.33W; Resistance: 0.1Ω; Resistance Tolerance: +/-1%

## Nets that join several sheets
+3V3: 000_Main (27 pins), 001_NUCLEO (R4.2 R5.2 R6.2 R7.2), 002_Servos (7 pins)
+5V: 000_Main (9 pins), 001_NUCLEO (C11.2 U1.CN11_24)
+48V: 000_Main (23 pins), 002_Servos (PS4.1)
GND: 000_Main (134 pins), 001_NUCLEO (17 pins), 002_Servos (32 pins)
DC1_V: 000_Main (D11.3 R11.1 R16.2), 001_NUCLEO (U1.CN12_62)
DC2_V: 000_Main (D12.3 R13.1 R17.2), 001_NUCLEO (U1.CN12_24)
GPIO1: 000_Main (J11.13 J11.14), 001_NUCLEO (U1.CN12_30)
GPIO2: 000_Main (J11.15 J11.16), 001_NUCLEO (U1.CN12_28)
GPIO3: 000_Main (J11.17 J11.18), 001_NUCLEO (U1.CN12_26)
Interrupt_Fuses: 001_NUCLEO (U1.CN12_29), 002_Servos (B1.1)
M1_PWM: 000_Main (J11.1 J11.2 P6.1), 001_NUCLEO (U1.CN12_52)
M2_PWM: 000_Main (J11.3 J11.4 P6.2), 001_NUCLEO (U1.CN12_56)
M3_PWM: 000_Main (J11.5 J11.6 P6.3), 001_NUCLEO (U1.CN12_55)
M4_PWM: 000_Main (J11.7 J11.8 P6.4), 001_NUCLEO (U1.CN12_51)
M5_PWM: 000_Main (J11.9 J11.10 P6.5), 001_NUCLEO (U1.CN12_4)
M6_PWM: 000_Main (J11.11 J11.12 P6.6), 001_NUCLEO (U1.CN12_19)
M_I2C_SCL: 000_Main (P4.3 X4.A2), 001_NUCLEO (R5.1 U1.CN12_17), 002_Servos (B1.22)
M_I2C_SDA: 000_Main (P4.1 X4.A1), 001_NUCLEO (R6.1 U1.CN12_5), 002_Servos (B1.23)
NRST: 000_Main (P2.5), 001_NUCLEO (U1.CN11_14)
RPI_UART_RX: 000_Main (P1.10), 001_NUCLEO (U1.CN11_57)
RPI_UART_TX: 000_Main (P1.8), 001_NUCLEO (U1.CN11_55)
S1_PWM: 000_Main (P6.7), 001_NUCLEO (U1.CN12_25), 002_Servos (J3.1 J3.2)
S2_PWM: 000_Main (P6.8), 001_NUCLEO (U1.CN12_18), 002_Servos (J3.3 J3.4)
S3_PWM: 000_Main (P5.1), 001_NUCLEO (U1.CN12_11), 002_Servos (J3.5 J3.6)
S4_PWM: 000_Main (P5.3), 001_NUCLEO (U1.CN12_43), 002_Servos (J3.7 J3.8)
S5_PWM: 000_Main (P5.5), 001_NUCLEO (U1.CN12_41), 002_Servos (J3.9 J3.10)
S6_PWM: 000_Main (P5.7), 001_NUCLEO (U1.CN12_46), 002_Servos (J3.11 J3.12)
S7_PWM: 000_Main (P5.2), 001_NUCLEO (U1.CN12_48), 002_Servos (J3.13 J3.14)
S8_PWM: 000_Main (P5.4), 001_NUCLEO (U1.CN12_2), 002_Servos (J3.15 J3.16)
S9_PWM: 000_Main (P5.6), 001_NUCLEO (U1.CN12_1), 002_Servos (J3.17 J3.18)
SSPI1_CS1: 000_Main (P4.4 X4.A7), 001_NUCLEO (U1.CN12_21)
SSPI1_CS2: 000_Main (P4.6 X4.A8), 001_NUCLEO (U1.CN12_33)
SSPI1_CS3: 000_Main (P4.8 X4.A9), 001_NUCLEO (U1.CN12_14)
SSPI1_CS4: 000_Main (X4.B5), 001_NUCLEO (U1.CN12_12)
SSPI1_MISO: 000_Main (P4.7 X4.A4), 001_NUCLEO (U1.CN11_63)
SSPI1_MOSI: 000_Main (P4.5 X4.A3), 001_NUCLEO (U1.CN11_45)
SSPI1_SCK: 000_Main (P4.2 X4.A5), 001_NUCLEO (U1.CN12_31)
SSPI2_CS_Current: 000_Main (P5.8), 001_NUCLEO (U1.CN11_4), 002_Servos (IC3.4)
SSPI2_CS_Current_Motors: 000_Main (IC1.4), 001_NUCLEO (U1.CN11_3)
SSPI2_MISO: 000_Main (IC1.27), 001_NUCLEO (U1.CN11_2), 002_Servos (IC3.27)
SSPI2_MOSI: 000_Main (IC1.28), 001_NUCLEO (U1.CN12_22), 002_Servos (IC3.28)
SSPI2_SCK: 000_Main (IC1.3), 001_NUCLEO (U1.CN11_1), 002_Servos (IC3.3)
SWCLK: 000_Main (P2.3), 001_NUCLEO (U1.CN11_15)
SWDIO: 000_Main (P2.1), 001_NUCLEO (U1.CN11_13)